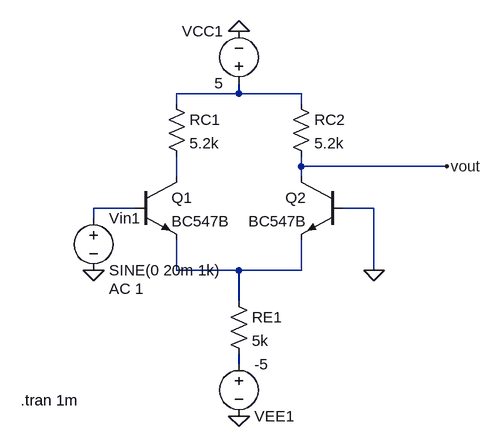
[diagram p0: schematic pre-amp.asc]
pre-amp.asc, the LTspice schematic file:
Version 4
SHEET 1 880 680
WIRE 48 -80 48 -96
WIRE 48 -80 -48 -80
WIRE 144 -80 48 -80
WIRE -48 -64 -48 -80
WIRE 144 -64 144 -80
WIRE 144 32 144 16
WIRE 368 32 144 32
WIRE -48 48 -48 16
WIRE 144 48 144 32
WIRE -112 96 -176 96
WIRE 256 96 208 96
WIRE -176 112 -176 96
WIRE -48 192 -48 144
WIRE 48 192 -48 192
WIRE 144 192 144 144
WIRE 144 192 48 192
WIRE 256 192 256 96
WIRE 48 240 48 192
WIRE 48 336 48 320
FLAG 48 -176 0
FLAG -176 192 0
FLAG 256 192 0
FLAG 48 416 0
FLAG 368 32 vout
SYMBOL res -64 -80 R0
SYMATTR InstName RC1
SYMATTR Value 5.2k
SYMBOL res 128 -80 R0
SYMATTR InstName RC2
SYMATTR Value 5.2k
SYMBOL npn -112 48 R0
SYMATTR InstName Q1
SYMATTR Value BC547B
SYMBOL npn 208 48 M0
SYMATTR InstName Q2
SYMATTR Value BC547B
SYMBOL res 32 224 R0
SYMATTR InstName RE1
SYMATTR Value 5k
SYMBOL voltage 48 -80 R180
WINDOW 0 24 96 Left 2
WINDOW 3 24 16 Left 2
WINDOW 123 0 0 Left 0
WINDOW 39 0 0 Left 0
SYMATTR InstName VCC1
SYMATTR Value 5
SYMBOL voltage -176 96 R0
WINDOW 123 24 124 Left 2
WINDOW 39 0 0 Left 0
SYMATTR Value2 AC 1
SYMATTR InstName Vin1
SYMATTR Value SINE(0 20m 1k)
SYMBOL voltage 48 320 R0
WINDOW 0 24 96 Left 2
WINDOW 3 24 16 Left 2
WINDOW 123 0 0 Left 0
WINDOW 39 0 0 Left 0
SYMATTR InstName VEE1
SYMATTR Value -5
TEXT -288 392 Left 2 !.tran 1m

The netlist it stands for:
* pre-amp.asc
RC1 N001 N002 5.2k
RC2 N001 vout 5.2k
Q1 N002 N003 N004 0 BC547B
Q2 vout 0 N004 0 BC547B
RE1 N004 N005 5k
VCC1 N001 0 5
Vin1 N003 0 SINE(0 20m 1k) AC 1
VEE1 N005 0 -5
.model NPN NPN
.model PNP PNP
.lib standard.bjt
.tran 1m
.backanno
.end